# Altium schematic sheet TopSheet.SchDoc
size A4; Organization: UltraZohm; DocumentNumber: 1; SheetNumber: 1; SheetTotal: 11; Website: www.ultrazohm.com
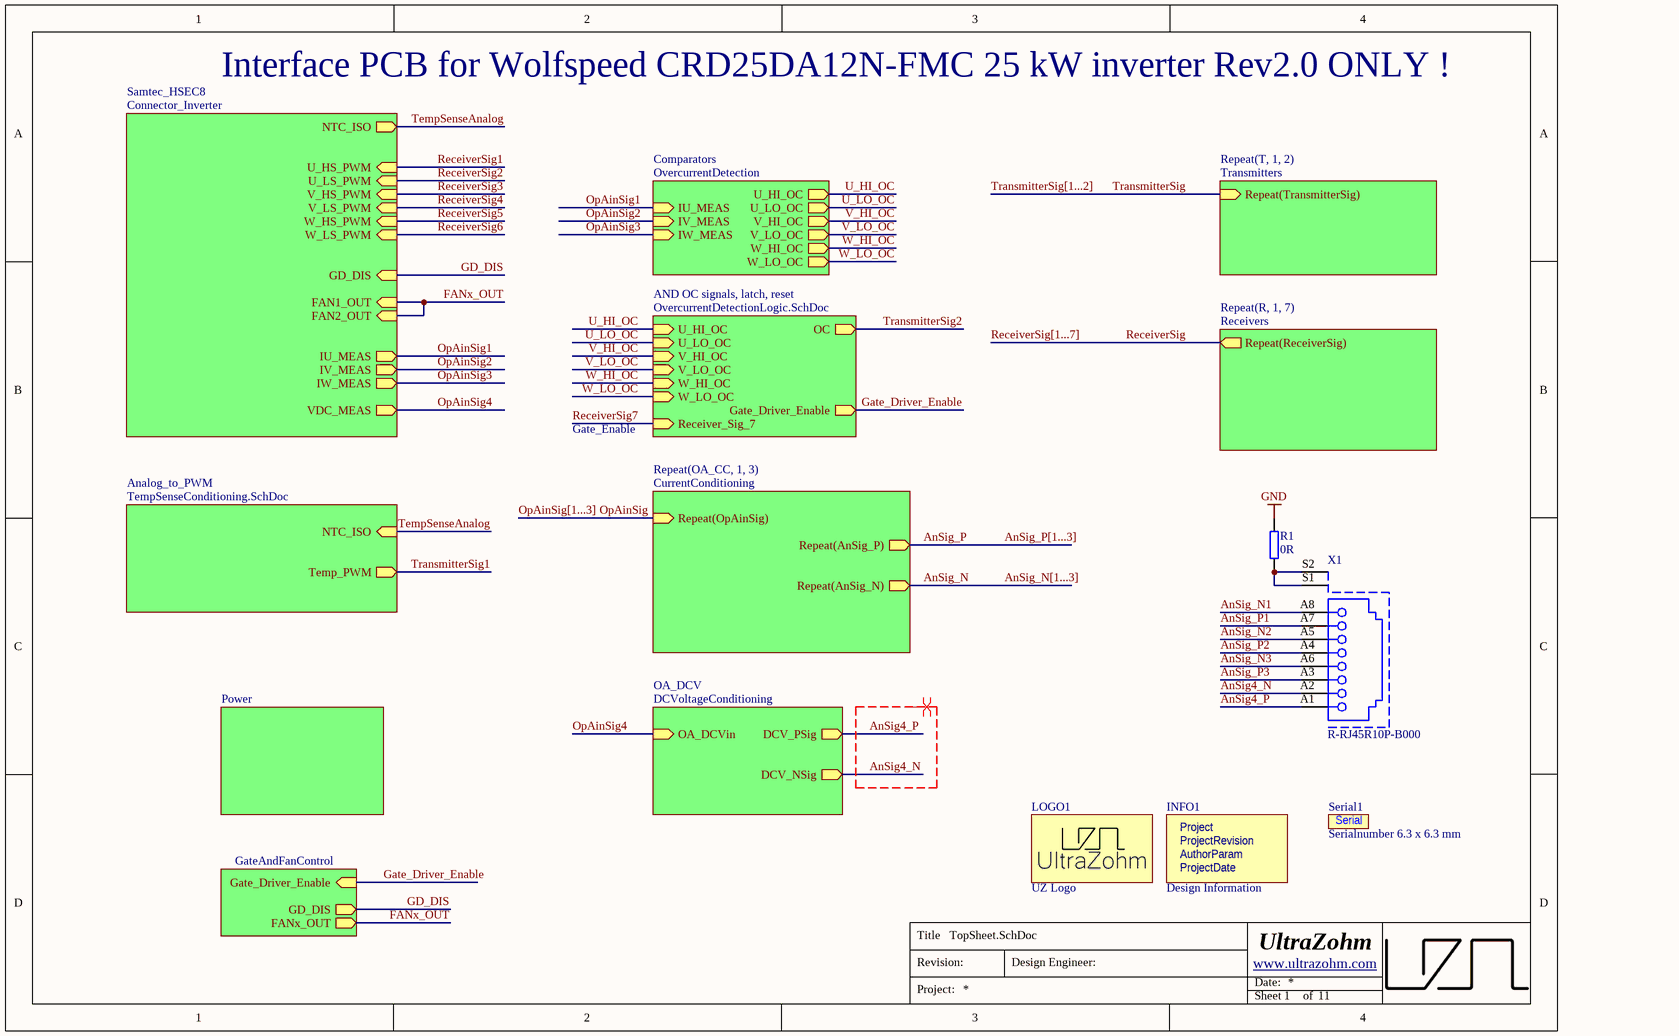
[diagram p0: TopSheet.SchDoc]

## Parts
INFO1  Design Information  [Design_info]  (no BOM)
LOGO1  UZ Logo  [UZ_Logo_small]  (no BOM)
R1  0R  [RES 0603_1608]
Serial1  Serialnumber 6.3 x 6.3 mm  [SERIAL_6.3X6.3MM]  (no BOM)
X1  R-RJ45R10P-B000  [R-RJ45R10P-B000]

## Sub-sheets
Analog_to_PWM = TempSenseConditioning.SchDoc: NTC_ISO (in), Temp_PWM (out)
AND OC signals, latch, reset = OvercurrentDetectionLogic.SchDoc: U_HI_OC (in), U_LO_OC (in), V_HI_OC (in), V_LO_OC (in), W_HI_OC (in), OC (out), W_LO_OC (in), Receiver_Sig_7 (in), Gate_Driver_Enable (out)
Comparators = OvercurrentDetection: IU_MEAS (in), IV_MEAS (in), IW_MEAS (in), U_HI_OC (out), U_LO_OC (out), V_HI_OC (out), V_LO_OC (out), W_HI_OC (out), W_LO_OC (out)
Designator = Power: no entries
Gate_and_Fan_Control = GateAndFanControl: FANx_OUT (out), GD_DIS (out), Gate_Driver_Enable (in)
OA_DCV = DCVoltageConditioning: OA_DCVin (in), DCV_PSig (out), DCV_NSig (out)
Repeat(OA_CC, 1, 3) = CurrentConditioning: Repeat(OpAinSig) (in), Repeat(AnSig_P) (out), Repeat(AnSig_N) (out)
Repeat(R, 1, 7) = Receivers: Repeat(ReceiverSig) (out)
Repeat(T, 1, 2) = Transmitters: Repeat(TransmitterSig) (in)
Samtec_HSEC8 = Connector_Inverter: NTC_ISO (out), U_HS_PWM (in), U_LS_PWM (in), V_HS_PWM (in), V_LS_PWM (in), W_HS_PWM (in), W_LS_PWM (in), GD_DIS (in), FAN1_OUT (in), FAN2_OUT (in), IU_MEAS (out), IV_MEAS (out), IW_MEAS (out), VDC_MEAS (out)

## Nets
GND: R1.1
AnSig4_N: X1.A2 ; sheet OA_DCV/DCV_NSig
AnSig4_P: X1.A1 ; sheet OA_DCV/DCV_PSig
AnSig_N: sheet Repeat(OA_CC, 1, 3)/Repeat(AnSig_N)
AnSig_N1: X1.A8
AnSig_N2: X1.A5
AnSig_N3: X1.A6
AnSig_P: sheet Repeat(OA_CC, 1, 3)/Repeat(AnSig_P)
AnSig_P1: X1.A7
AnSig_P2: X1.A4
AnSig_P3: X1.A3
FANx_OUT: sheet Samtec_HSEC8/FAN1_OUT, sheet Samtec_HSEC8/FAN2_OUT, sheet Gate_and_Fan_Control/FANx_OUT
Gate_Driver_Enable: sheet Gate_and_Fan_Control/Gate_Driver_Enable, sheet AND OC signals, latch, reset/Gate_Driver_Enable
GD_DIS: sheet Samtec_HSEC8/GD_DIS, sheet Gate_and_Fan_Control/GD_DIS
OpAinSig: sheet Repeat(OA_CC, 1, 3)/Repeat(OpAinSig)
OpAinSig1: sheet Samtec_HSEC8/IU_MEAS, sheet Comparators/IU_MEAS
OpAinSig2: sheet Samtec_HSEC8/IV_MEAS, sheet Comparators/IV_MEAS
OpAinSig3: sheet Samtec_HSEC8/IW_MEAS, sheet Comparators/IW_MEAS
OpAinSig4: sheet Samtec_HSEC8/VDC_MEAS, sheet OA_DCV/OA_DCVin
ReceiverSig: sheet Repeat(R, 1, 7)/Repeat(ReceiverSig)
ReceiverSig1: sheet Samtec_HSEC8/U_HS_PWM
ReceiverSig2: sheet Samtec_HSEC8/U_LS_PWM
ReceiverSig3: sheet Samtec_HSEC8/V_HS_PWM
ReceiverSig4: sheet Samtec_HSEC8/V_LS_PWM
ReceiverSig5: sheet Samtec_HSEC8/W_HS_PWM
ReceiverSig6: sheet Samtec_HSEC8/W_LS_PWM
ReceiverSig7: sheet AND OC signals, latch, reset/Receiver_Sig_7
TempSenseAnalog: sheet Samtec_HSEC8/NTC_ISO, sheet Analog_to_PWM/NTC_ISO
TransmitterSig: sheet Repeat(T, 1, 2)/Repeat(TransmitterSig)
TransmitterSig1: sheet Analog_to_PWM/Temp_PWM
TransmitterSig2: sheet AND OC signals, latch, reset/OC
U_HI_OC: sheet Comparators/U_HI_OC, sheet AND OC signals, latch, reset/U_HI_OC
U_LO_OC: sheet Comparators/U_LO_OC, sheet AND OC signals, latch, reset/U_LO_OC
V_HI_OC: sheet Comparators/V_HI_OC, sheet AND OC signals, latch, reset/V_HI_OC
V_LO_OC: sheet Comparators/V_LO_OC, sheet AND OC signals, latch, reset/V_LO_OC
W_HI_OC: sheet Comparators/W_HI_OC, sheet AND OC signals, latch, reset/W_HI_OC
W_LO_OC: sheet Comparators/W_LO_OC, sheet AND OC signals, latch, reset/W_LO_OC
NetR1_2: R1.2 X1.S1 X1.S2

## Buses and harness runs
bus AnSig_N[1...3]
bus AnSig_P[1...3]
bus OpAinSig[1...3]
bus ReceiverSig[1...7]
bus TransmitterSig[1...2]

## Layout directives
differential pair: AnSig4_N, AnSig4_P

## Notes on the sheet
- Interface PCB for Wolfspeed CRD25DA12N-FMC 25 kW inverter Rev2.0 ONLY !
- Gate_Enable
- Title
- Revision:
- Design Engineer:
- Date:
- Project:
- Sheet
- of
- (in symbol Design Information) Project; ProjectRevision; AuthorParam; ProjectDate
- (in symbol Serial Number) Serial

## Library data of the parts
INFO1 = Design Information: Manufacturer: UltraZohm; Created from: MGremer; Manufacturer Part Number: Design Information; PartID: 12; Created On: 03/11/2021 09:04:23; ComponentLink1Description: https://docs.ultrazohm.com/; ComponentLink1URL: homepage; Component Type: Design Information; Last Updated: 03/11/2021 09:28:34; Supplier 1: -; Supplier Part Number 1: -; Type: Design Information; Value: Design Information; Live Cycle Status: 1
LOGO1 = Logo small: Manufacturer: UltraZohm; Created from: MGremer; Created: Jan2021_Liegmann; Value: Logo; Manufacturer Part Number: Logo small; PartID: 10; Created On: 03.11.2021 09:04:23; ComponentLink1Description: https://docs.ultrazohm.com/; ComponentLink1URL: homepage; Component Type: Logo; Last Updated: 03.11.2021 09:05:50; Supplier 1: -; Supplier Part Number 1: -; Type: Logo; Live Cycle Status: 1
R1 = RC0603JR-070RL: SMD resistor E24 series; Manufacturer: YAGEO; Tolerance: 5%; Created from: MGremer; Manufacturer Part Number: RC0603JR-070RL; PartID: 1; Created On: 14/12/2020 16:17:14; ComponentLink1Description: Datasheet; ComponentLink1URL: https://www.mouser.de/datasheet/2/447/PYu-RC_Group_51_RoHS_L_10-1664068.pdf; Component Type: SMD resistor; Device Package: 0603; Last Updated: 04/03/2021 09:09:42; Mounting Type: SMD; Supplier 1: Mouser; Supplier Part Number 1: 603-RC0603JR-070RL; Supplier 2: LCSC; Supplier Part Number 2: C21189; Type: Resistor; Value: 0R; Live Cycle Status: 1; Stock number: Labor SMD Container; LCSC Part Number: C21189
Serial1 = Serial Number: Manufacturer: UltraZohm; Value: REV; Created from: MGremer; Created: 2018_09_18_AGeiger; Manufacturer Part Number: Serial Number; PartID: 11; Created On: 03.11.2021 09:04:23; ComponentLink1Description: https://docs.ultrazohm.com/; ComponentLink1URL: homepage; Component Type: Serial Number; Last Updated: 03.11.2021 09:28:34; Supplier 1: -; Supplier Part Number 1: -; Type: Serial Number; Live Cycle Status: 1
X1 = R-RJ45R10P-B000: LCSC Part Number: C386758